# Altium schematic sheet sismikenkazmod.SchDoc
size A4
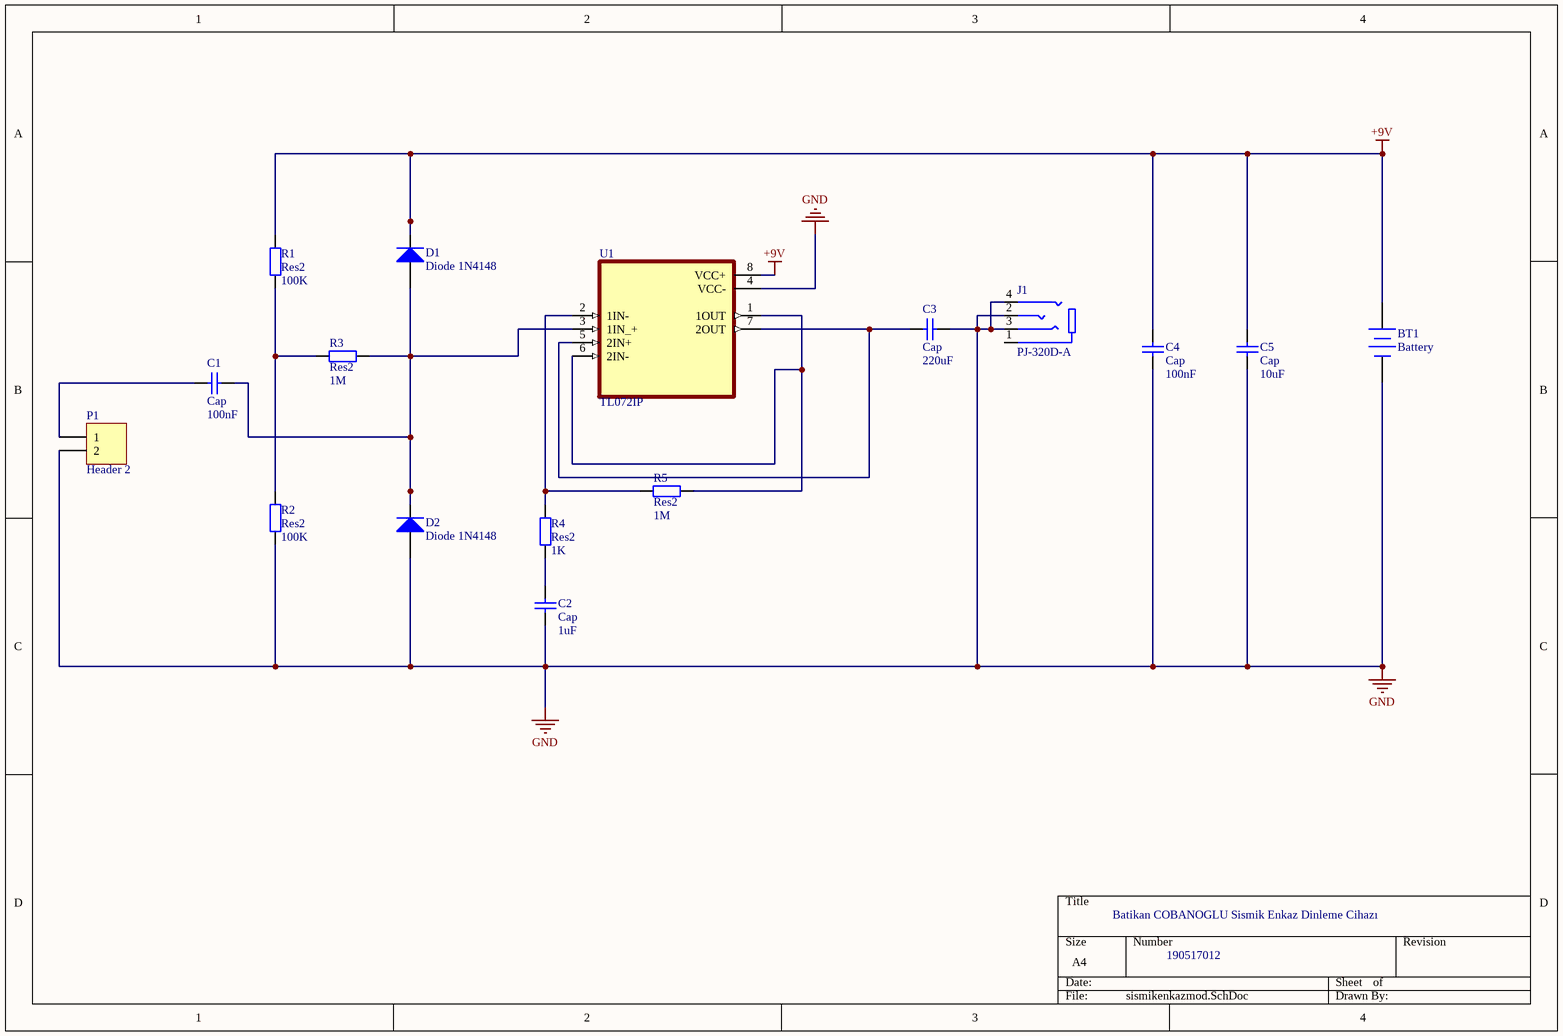
[diagram p0: sismikenkazmod.SchDoc]

## Parts
BT1  Battery  [BAT-2]
C1  Cap  value 100nF  [RAD-0.3]
C2  Cap  value 1uF  [RAD-0.3]
C3  Cap  value 220uF  [RAD-0.3]
C4  Cap  value 100nF  [RAD-0.3]
C5  Cap  value 10uF  [RAD-0.3]
D1  Diode 1N4148  [DO-35]
D2  Diode 1N4148  [DO-35]
J1  PJ-320D-A  [HRO_PJ-320D-A]
P1  Header 2  [HDR1X2]
R1  Res2  value 100K  [AXIAL-0.4]
R2  Res2  value 100K  [AXIAL-0.4]
R3  Res2  value 1M  [AXIAL-0.4]
R4  Res2  value 1K  [AXIAL-0.4]
R5  Res2  value 1M  [AXIAL-0.4]
U1  TL072IP  [DIP794W45P254L959H508Q8]

## Nets
+9V: BT1.1(+) C4.1 C5.1 D1.2(K) R1.1 U1.8(VCC+)
GND: BT1.2(-) C2.1 C3.2 C4.2 C5.2 D2.1(A) J1.2(TIP) J1.3(RING1) J1.4(RING2) P1.2 R2.2 U1.4(VCC-)
NetC1_1: C1.1 P1.1
NetC1_2: C1.2 D1.1(A) D2.2(K) R3.2 U1.3(1IN_+)
NetC2_2: C2.2 R4.2
NetC3_1: C3.1 U1.5(2IN+) U1.7(2OUT)
NetR1_2: R1.2 R2.1 R3.1
NetR4_1: R4.1 R5.1 U1.2(1IN-)
NetR5_2: R5.2 U1.1(1OUT) U1.6(2IN-)

Not connected (* = marked no-connect by the designer): J1 1(SLEEVE)

## Notes on the sheet
- Batikan COBANOGLU Sismik Enkaz Dinleme Cihazı
- 190517012

## Library data of the parts
BT1 = Battery: Multicell Battery; Published: 24-Mar-1999; LatestRevisionDate: 17-Jul-2002; LatestRevisionNote: Re-released for DXP Platform.; PackageReference: BAT-2; Publisher: Altium Limited; PackageDescription: Battery; 2 Leads
C1-C5 = Cap: Capacitor; Published: 8-Jun-2000; LatestRevisionDate: 17-Jul-2002; LatestRevisionNote: Re-released for DXP Platform.; PackageReference: RAD-0.3; Publisher: Altium Limited; PackageDescription: Radial Cap, Thru-Hole; 2 Leads; 0.3 in Pin Spacing
D1 D2 = Diode 1N4148: High Conductance Fast Diode; Published: 8-Jun-2000; LatestRevisionDate: 17-Jul-2002; LatestRevisionNote: Re-released for DXP Platform.; DatasheetVersion: 1997; PackageReference: DO-35; Publisher: Altium Limited; PackageDescription: Diode, Axial; Body 3.8 x 1.9 mm (LxDia. max), Lead Dia. 0.53 mm (max); Code_JEDEC: DO-204-AH; ComponentLink1Description: Manufacturer Link; ComponentLink1URL: http://www.fairchildsemi.com/; ComponentLink2Description: Datasheet; ComponentLink2URL: http://www.fairchildsemi.com/ds/1N%2F1N4148.pdf
J1 = PJ-320D-A: Headphone jack 0.5A 30V DC 100 mÎ©; MF: HRO Electronics Co., Ltd.; Package: Package; MP: PJ-320D-A; Check_prices: https://www.snapeda.com/parts/PJ-320D-A/HRO+Electronics+Co.%252C+Ltd./view-part/?ref=eda; Value: *; Availability: Not in stock; Price: None; SnapEDA_Link: https://www.snapeda.com/parts/PJ-320D-A/HRO+Electronics+Co.%252C+Ltd./view-part/?ref=snap
P1 = Header 2: Header, 2-Pin; LatestRevisionDate: 17-Jul-2002; LatestRevisionNote: Re-released for DXP Platform.; Publisher: Altium Limited
R1-R5 = Res2: Resistor; Published: 8-Jun-2000; LatestRevisionDate: 17-Jul-2002; LatestRevisionNote: Re-released for DXP Platform.; PackageReference: AXIAL-0.4; Publisher: Altium Limited; PackageDescription: Axial Device, Thru-Hole; 2 Leads; 0.4 in Pin Spacing
U1 = TL072IP: Dual, 30-V, 3-MHz, high slew rate (13-V/Âµs), In to V+, JFET-input op amp; MF: Texas Instruments; Price: None; Package: PDIP-8 Texas; Purchase-URL: https://pricing.snapeda.com/search/part/TL072IP/?ref=eda; Availability: In Stock; SnapEDA_Link: https://www.snapeda.com/parts/TL072IP/Texas+Instruments/view-part/?ref=snap; Value: *; MP: TL072IP; Check_prices: https://www.snapeda.com/parts/TL072IP/Texas+Instruments/view-part/?ref=eda